# Altium project RYA_MotorDriver.PrjPcb
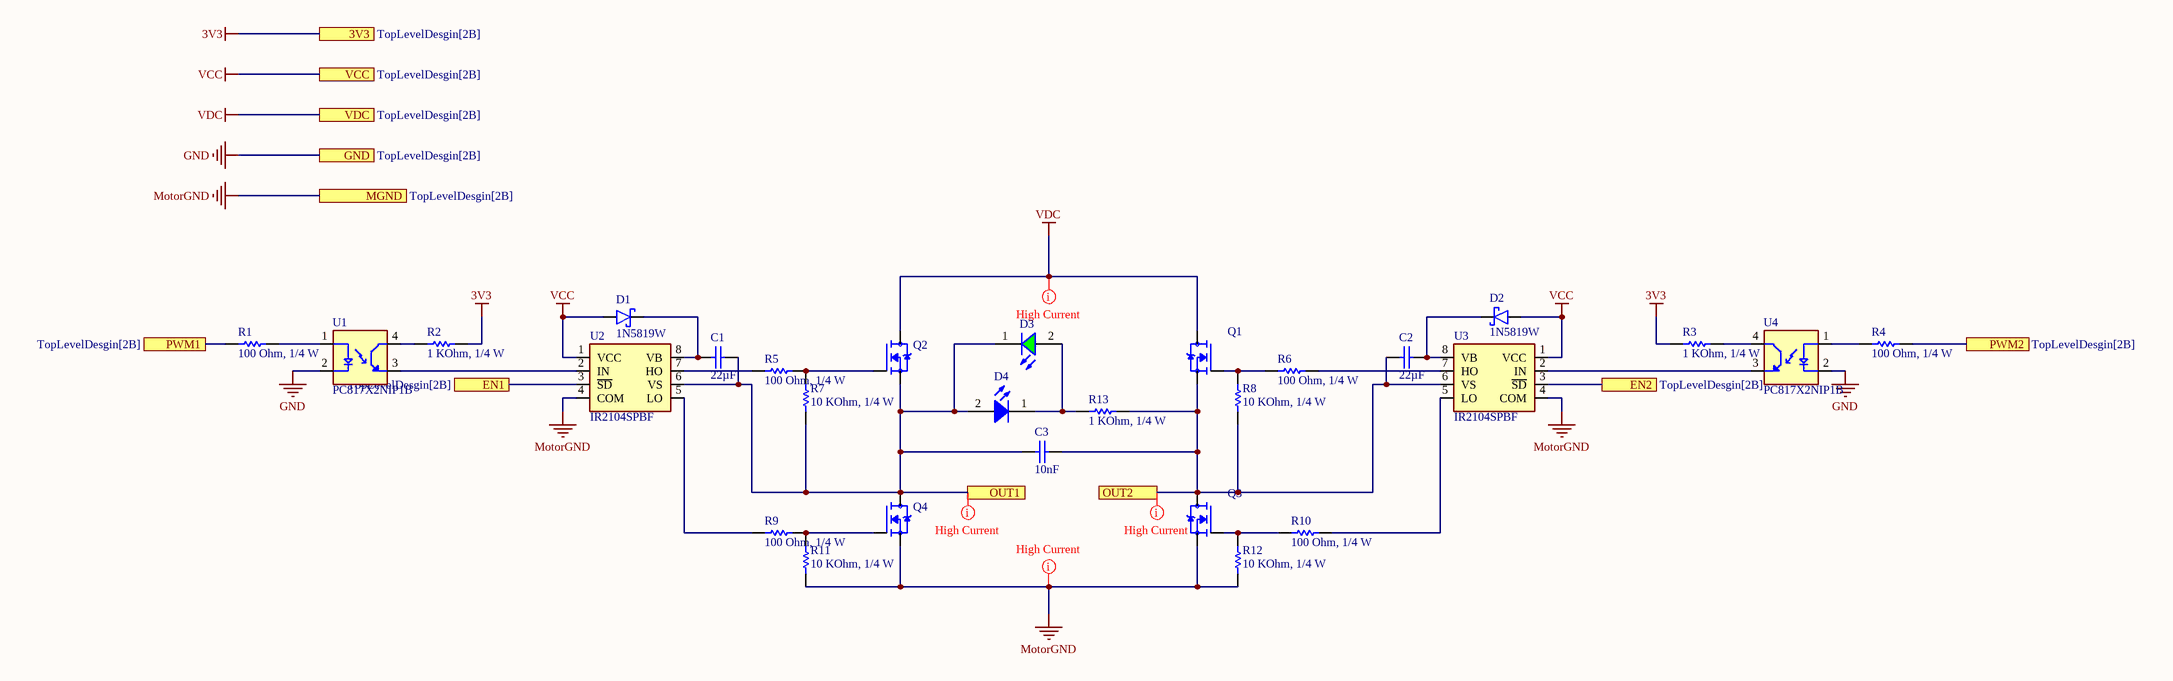
[diagram p0: MotorDriver.SchDoc]
1 sheet, 28 parts. Net scope: flat (ports and power ports of the same name join across sheets).
Board file: RYA_MotorDriver.PcbDoc

## Sheet MotorDriver.SchDoc
size B; SheetNumber: 2; SheetTotal: 2

### Parts
C1  value 22µF  [CAP_0603]  (hidden comment: 010603226106.3)
C2  value 22µF  [CAP_0603]  (hidden comment: 010603226106.3)
C3  value 10nF  [CAP_0805]  (hidden comment: 0108051031050)
D1  1N5819W  [1N5819W]
D2  1N5819W  [1N5819W]
D3  160603GreenClear  [WL-SMCW_0603_H=0.7mm]  (value not drawn)
D4  160603BlueClear  [WL-SMCW_0603_H=0.7mm]  (value not drawn)
Q1  IRLR7843TRPBF  [TO229P990X239-3_4N]  (value not drawn)
Q2  IRLR7843TRPBF  [TO229P990X239-3_4N]  (value not drawn)
Q3  IRLR7843TRPBF  [TO229P990X239-3_4N]  (value not drawn)
Q4  IRLR7843TRPBF  [TO229P990X239-3_4N]  (value not drawn)
R1  value 100 Ohm, 1/4 W  [resistor_0603]  (hidden comment: 0006031011)
R2  value 1 KOhm, 1/4 W  [resistor_0603]  (hidden comment: 0006031021)
R3  value 1 KOhm, 1/4 W  [resistor_0603]  (hidden comment: 0006031021)
R4  value 100 Ohm, 1/4 W  [resistor_0603]  (hidden comment: 0006031011)
R5  value 100 Ohm, 1/4 W  [resistor_0603]  (hidden comment: 0006031011)
R6  value 100 Ohm, 1/4 W  [resistor_0603]  (hidden comment: 0006031011)
R7  value 10 KOhm, 1/4 W  [resistor_0603]  (hidden comment: 0006031031)
R8  value 10 KOhm, 1/4 W  [resistor_0603]  (hidden comment: 0006031031)
R9  value 100 Ohm, 1/4 W  [resistor_0603]  (hidden comment: 0006031011)
R10  value 100 Ohm, 1/4 W  [resistor_0603]  (hidden comment: 0006031011)
R11  value 10 KOhm, 1/4 W  [resistor_0603]  (hidden comment: 0006031031)
R12  value 10 KOhm, 1/4 W  [resistor_0603]  (hidden comment: 0006031031)
R13  value 1 KOhm, 1/4 W  [resistor_0603]  (hidden comment: 0006031021)
U1  PC817X2NIP1B  [SOIC254P960X420-4N]
U2  IR2104SPBF  [IR2104SPBF]
U3  IR2104SPBF  [IR2104SPBF]
U4  PC817X2NIP1B  [SOIC254P960X420-4N]

### Ports
3V3 (see TopLevelDesgin[2B]), EN1 (see TopLevelDesgin[2B]), EN2 (see TopLevelDesgin[2B]), GND (see TopLevelDesgin[2B]), MGND (see TopLevelDesgin[2B]), OUT1 (see TopLevelDesgin[3B]), OUT2 (see TopLevelDesgin[3B]), PWM1 (see TopLevelDesgin[2B]), PWM2 (see TopLevelDesgin[2B]), VCC (see TopLevelDesgin[2B]), VDC (see TopLevelDesgin[2B])

### Nets
3V3: R2.2 R3.1 ; port 3V3
GND: U1.2(C) U4.2(C) ; port GND
MotorGND: Q3.3(S) Q4.3(S) R11.1 R12.1 U2.4(COM) U3.4(COM) ; port MGND
VCC: D1.A D2.A U2.1(VCC) U3.1(VCC) ; port VCC
VDC: Q1.4(D) Q2.4(D) ; port VDC
NetC1_1: C1.1 D1.K U2.8(VB)
NetC1_2: C1.2 C3.1 D3.1(K) D4.2(A) Q2.3(S) Q4.4(D) R7.1 U2.6(VS) ; port OUT1
NetC2_1: C2.1 C3.2 Q1.3(S) Q3.4(D) R8.1 R13.2 U3.6(VS) ; port OUT2
NetC2_2: C2.2 D2.K U3.8(VB)
NetD3_2: D3.2(A) D4.1(K) R13.1
NetQ1_1: Q1.1(G) R6.1 R8.2
NetQ2_1: Q2.1(G) R5.2 R7.2
NetQ3_1: Q3.1(G) R10.1 R12.2
NetQ4_1: Q4.1(G) R9.2 R11.2
NetR1_1: R1.1 ; port PWM1
NetR1_2: R1.2 U1.1(A)
NetR2_1: R2.1 U1.4(CT)
NetR3_2: R3.2 U4.4(CT)
NetR4_1: R4.1 U4.1(A)
NetR4_2: R4.2 ; port PWM2
NetR5_1: R5.1 U2.7(HO)
NetR6_2: R6.2 U3.7(HO)
NetR9_1: R9.1 U2.5(LO)
NetR10_2: R10.2 U3.5(LO)
NetU1_3: U1.3(ET) U2.2(IN)
NetU2_3: U2.3(~{SD}) ; port EN1
NetU3_2: U3.2(IN) U4.3(ET)
NetU3_3: U3.3(~{SD}) ; port EN2

### Layout directives
rule Width Constraint [Pref Width = 30mil    Min Width = 30mil    Max Width = 100mil]; net class Motor Power: MotorGND, NetC1_2, NetC2_1, VDC

### Library data of the parts
C1 C2 = CMP-001-00237-1: CAP, size 0603, 22 uF, 6.3 VDC; Manufacture SN: CL10A226KQ8NRNE; Manufacture Name: Samsung Electro-Mechanics; Tolerance: 10%; Voltage Rating DC: 6.3 VDC; Supplier 1 Name: Mouser; Size: 0603; Operating Temperature: -55 to +125degC; Supplier 2 SN: 1276-2867-2-ND; Supplier 1 URL: https://www.mouser.vn/ProductDetail/Samsung-Electro-Mechanics/CL10A226KQ8NRNE?qs=NrXEK%2Fuukt63rpgsAsB8kg%3D%3D&utm_source=mouser-refine-download&utm_medium=file&utm_campaign=CL10A226KQ8NRNE&utm_content=Samsung-Electro-Mechanics; Mounting Technology: SMT; Supplier 1 SN: 187-CL10A226KQ8NRNE; Source: Capacitor_0603_10_percent.SchLib; Supplier 3 URL: N/A; Pins: 2; Packaging: Tape and Reel; Supplier 2 Name: Digi-Key; Component Type: Standard; Supplier 3 Name: thegioiic; Supplier 3 SN: N/A; Supplier 2 URL: https://www.digikey.com/en/products/detail/samsung-electro-mechanics/cl10a226kq8nrne/3888525; Design Item ID: 010603226106.3
C3 = CMP-001-00258-1: CAP, size 0805, 10 nF, 50 VDC; Manufacture Name: TDK; Manufacture SN: CGA4C2C0G1H103J060AA; Tolerance: 5%; Voltage Rating DC: 50 VDC; Supplier 3 Name: thegioiic; Supplier 1 URL: https://www.mouser.vn/ProductDetail/TDK/CGA4C2C0G1H103J060AA?qs=FxQuwy19cyC9M6v0nMqjhA%3D%3D&utm_source=mouser-refine-download&utm_medium=file&utm_campaign=CGA4C2C0G1H103J060AA&utm_content=TDK; Supplier 2 URL: https://www.digikey.com/en/products/detail/tdk-corporation/cga4c2c0g1h103j060aa/2672840; Supplier 1 SN: 810-CGA4C2C0G1H103J; Packaging: Tape and Reel; Supplier 3 SN: OEM; Mounting Technology: SMT; Supplier 3 URL: N/A; Supplier 2 Name: Digi-Key; Supplier 1 Name: Mouser; Source: Capacitor_0805_5_percent.SchLib; Operating Temperature: -55 to +125degC; Pins: 2; Supplier 2 SN: 445-6947-2-ND; Design Item ID: 0108051031050; Size: 0805; Component Type: Standard
D1 D2 = CMP-004-00113-1: Source: 1N5819W.SchLib; Design Item ID: 1N5819W; Pins: 2; Component Type: Standard
D3 = CMP-004-00090-1: WL-SMCW SMT Mono-color Chip LED Waterclear, size 0603, Green, 3.2V, 140deg; Type: Clear; ComponentLink2Description: Supplier 1 URL; ComponentLink4Description: Supplier 3 URL; ComponentLink4URL: https://www.thegioiic.com/led-xanh-la-0603-dan-smd-trong-suot; Supplier 3 Name: ICDayRoi; Supplier 1 Name: Mouser; ComponentLink1URL: N/A; Supplier 3 SN: N/A; Design Item ID: 160603GreenClear; ComponentLink1Description: Datasheet link; Supplier 2 URL: https://www.digikey.com/en/products/detail/liteon/LTST-C191KGKT/386835; Pins: 2; Value: Green, 3.2V; Size: 0603; ComponentLink2URL: https://www.mouser.vn/ProductDetail/Wurth-Elektronik/150060GS75000?qs=LlUlMxKIyB0UYkq5lDO8nA%3D%3D; Supplier 2 Name: Digi-Key; Component Type: Standard; Color: Green; Source: WL-SMCW_0603.SchLib; Supplier 3 URL: https://www.thegioiic.com/led-xanh-la-0603-dan-smd-trong-suot; ComponentLink3Description: Supplier 2 URL; Supplier 1 SN: 710-150060GS75000; Supplier 2 SN: 160-1446-2-ND; ComponentLink3URL: https://www.digikey.com/en/products/detail/liteon/LTST-C191KGKT/386835; Supplier 1 URL: https://www.mouser.vn/ProductDetail/Wurth-Elektronik/150060GS75000?qs=LlUlMxKIyB0UYkq5lDO8nA%3D%3D
D4 = CMP-004-00088-1: WL-SMCW SMT Mono-color Chip LED Waterclear, size 0603, Blue, 3.2V, 140deg; Type: Clear; Supplier 2 SN: 160-1647-2-ND; Pins: 2; Supplier 1 SN: 710-150060GS75000; ComponentLink3URL: https://www.digikey.com/en/products/detail/liteon/LTST-C191TBKT/388530; Color: Blue; Supplier 3 Name: ICDayRoi; Supplier 2 Name: Digi-Key; ComponentLink1URL: N/A; Source: WL-SMCW_0603.SchLib; ComponentLink4URL: https://www.thegioiic.com/led-xanh-duong-0603-dan-smd-trong-suot; Supplier 1 Name: Mouser; ComponentLink3Description: Supplier 2 URL; Component Type: Standard; ComponentLink1Description: Datasheet link; Value: Blue, 3.2V; ComponentLink2URL: https://www.mouser.vn/ProductDetail/Wurth-Elektronik/150060BS75003?qs=Li%252BoUPsLEnu8LvIbM48DKA%3D%3D; Size: 0603; Design Item ID: 160603BlueClear; Supplier 2 URL: https://www.digikey.com/en/products/detail/liteon/LTST-C191TBKT/388530; ComponentLink4Description: Supplier 3 URL; Supplier 3 URL: https://www.thegioiic.com/led-xanh-duong-0603-dan-smd-trong-suot; Supplier 3 SN: N/A; ComponentLink2Description: Supplier 1 URL; Supplier 1 URL: https://www.mouser.vn/ProductDetail/Wurth-Elektronik/150060BS75003?qs=Li%252BoUPsLEnu8LvIbM48DKA%3D%3D
Q1-Q4 = CMP-123-000003-1: RoHS Compliant; MF: Infineon Technologies; Design Item ID: IRLR7843TRPBF; SnapEDA_Link: https://www.snapeda.com/parts/IRLR7843TRPBF/Infineon+Technologies/view-part/?ref=snap; Price: None; Package: TO-252-3 Infineon; Availability: In Stock; Purchase-URL: https://pricing.snapeda.com/search/part/IRLR7843TRPBF/?ref=eda; Check_prices: https://www.snapeda.com/parts/IRLR7843TRPBF/Infineon+Technologies/view-part/?ref=eda; Component Type: Standard; Source: IRLR7843TRPBF.SchLib; Pin Count: 3; MP: IRLR7843TRPBF; Value: *
R1 R4-R6 R9 R10 = CMP-009-00184-1: RES, size 0603, 100 Ohm, 1/4 W; Manufacture  SN: OEM; Resistance Tolerance: +/-1%; Rated Power: 1/4 W; Supplier 2 URL: https://www.digikey.com/en/products/detail/yageo/SR0603FR-7T100RL/9373096https://www.digikey.com/en/products/detail/yageo/SR0603FR-7T100RL/9373096; Pins: 2; Supplier 1 Name: Mouser; Manufacture  Name: OEM; Design Item ID: 0006031011; Supplier 2 Name: Digi-Key; Supplier 2 SN: YAG5822TR-ND YAG5822CT-ND YAG5822DKR-ND; ComponentLink1URL: https://www.yageo.com/upload/media/product/productsearch/datasheet/rchip/PYu-SR_20105_RoHS_L_10.pdf; ComponentLink1Description: Datasheet link; ComponentLink4Description: Supplier 3 URL; Source: Resistor_0603.SchLib; Supplier 1 URL: https://www.mouser.vn/ProductDetail/YAGEO/SR0603FR-7T100RL?qs=sGAEpiMZZMvdGkrng054tz1y1XEHv7sNOEBvi%2FAEoxbcgRjDGFawVw%3D%3D; ComponentLink2Description: Supplier 1 URL; ComponentLink3Description: Supplier 2 URL; ComponentLink2URL: N/A; Supplier 3 URL: N/A; Size: 0603; ComponentLink3URL: https://www.digikey.com/en/products/detail/yageo/SR0603FR-7T100RL/9373096https://www.digikey.com/en/products/detail/yageo/SR0603FR-7T100RL/9373096; Supplier 3 Name: thegioiic; Supplier 1 SN: 603-SR0603FR-7T100RL; Supplier 3 SN: N/A; ComponentLink4URL: N/A; Mounting Technology: SMT; Component Type: Standard
R2 R3 R13 = CMP-009-00186-1: RES, size 0603, 1 KOhm, 1/4 W; Manufacture  SN: OEM; Rated Power: 1/4 W; Resistance Tolerance: +/-1%; Supplier 1 SN: 71-RCS06031K00FKEA; ComponentLink4Description: Supplier 3 URL; ComponentLink2Description: Supplier 1 URL; Supplier 3 SN: N/A; Supplier 2 Name: Digi-Key; ComponentLink3Description: Supplier 2 URL; Pins: 2; ComponentLink4URL: N/A; Source: Resistor_0603.SchLib; ComponentLink3URL: https://www.digikey.com/en/products/detail/yageo/SR0603FR-7T1KL/9373103; Supplier 2 SN: YAG5829TR-ND YAG5829CT-ND YAG5829DKR-ND; Supplier 2 URL: https://www.digikey.com/en/products/detail/yageo/SR0603FR-7T1KL/9373103; Supplier 1 Name: Mouser; Component Type: Standard; ComponentLink2URL: N/A; Size: 0603; Supplier 1 URL: https://www.mouser.vn/ProductDetail/Vishay-Dale/RCS06031K00FKEA?qs=sGAEpiMZZMvdGkrng054t9clqp6gtJJdzI9PGMrTQi4RTIuHToNahw%3D%3D; Supplier 3 URL: N/A; Design Item ID: 0006031021; Mounting Technology: SMT; ComponentLink1URL: https://www.yageo.com/upload/media/product/productsearch/datasheet/rchip/PYu-SR_20105_RoHS_L_10.pdf; ComponentLink1Description: Datasheet link; Supplier 3 Name: thegioiic; Manufacture  Name: OEM
R7 R8 R11 R12 = CMP-009-00188-1: RES, size 0603, 10 KOhm, 1/4 W; Manufacture  Name: OEM; Rated Power: 1/4 W; Resistance Tolerance: +/-1%; ComponentLink1Description: Datasheet link; Size: 0603; Supplier 2 SN: RHM10KADTR-ND RHM10KADCT-ND RHM10KADDKR-ND; Mounting Technology: SMT; ComponentLink2URL: N/A; Design Item ID: 0006031031; Supplier 1 Name: Mouser; Component Type: Standard; Supplier 2 URL: https://www.digikey.com/en/products/detail/rohm-semiconductor/ESR03EZPF1002/1983429; Manufacture  SN: OEM; Supplier 2 Name: Digi-Key; Supplier 3 URL: N/A; Source: Resistor_0603.SchLib; ComponentLink1URL: https://fscdn.rohm.com/en/products/databook/datasheet/passive/resistor/chip_resistor/esr-e.pdf; Pins: 2; ComponentLink3Description: Supplier 2 URL; Supplier 1 URL: https://www.mouser.vn/ProductDetail/ROHM-Semiconductor/ESR03EZPF1002?qs=sGAEpiMZZMvdGkrng054t67Efho1F8r6CDeAsqwFse8%3D; Supplier 1 SN: 755-ESR03EZPF1002; Supplier 3 SN: N/A; ComponentLink3URL: https://www.digikey.com/en/products/detail/rohm-semiconductor/ESR03EZPF1002/1983429; ComponentLink4Description: Supplier 3 URL; Supplier 3 Name: thegioiic; ComponentLink2Description: Supplier 1 URL; ComponentLink4URL: N/A
U1 U4 = CMP-036-000026-1: Optocoupler DC-IN 1-CH Transistor DC-OUT 4-Pin DIP SMD T/R; MF: Sharp Microelectronics; MP: PC817X2NIP1B; Design Item ID: PC817X2NIP1B; Check_prices: https://www.snapeda.com/parts/PC817X2NIP1B/Sharp+Microelectronics/view-part/?ref=eda; Package: SMD-4 Sharp Microelectronics; Source: PC817X2NIP1B.SchLib; Value: *; SnapEDA_Link: https://www.snapeda.com/parts/PC817X2NIP1B/Sharp+Microelectronics/view-part/?ref=snap
U2 U3 = CMP-031-00014-2: Half-Bridge Gate Driver IC Non-Inverting 8-SOIC; MF: Infineon; Pins: 8; Check_prices: https://www.snapeda.com/parts/IR2104SPBF/Infineon/view-part/?ref=eda; SnapEDA_Link: https://www.snapeda.com/parts/IR2104SPBF/Infineon/view-part/?ref=snap; Design Item ID: IR2104SPBF; Source: IR2104SPBF.SchLib; Component Type: Standard; Value: *; Case/Package: SOIC-8 Infineon; MP: IR2104SPBF